# Altium schematic sheet BigCreteTopLevel.SchDoc
size A
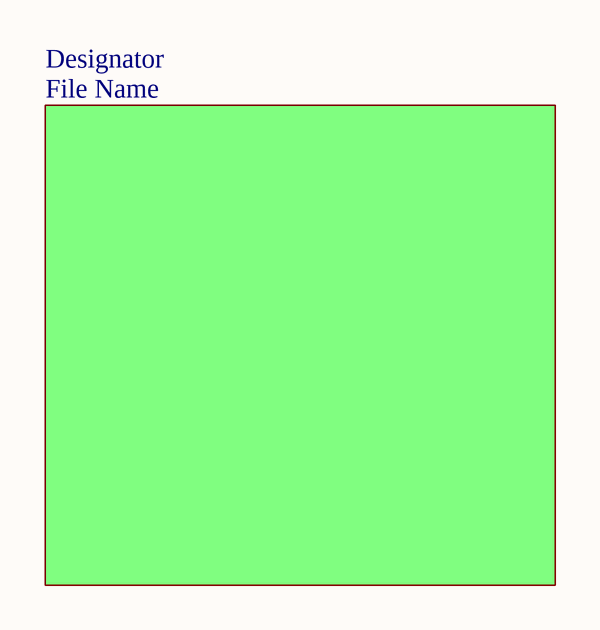
[diagram p0: BigCreteTopLevel.SchDoc]

## Sub-sheets
Designator = File Name: no entries